# Altium project Kasli-SOC.PrjPcb (part 5 of 11)

## Sheet Kasli-SOC_SFP.SchDoc: SFP
size 420 x 297 mm; EDA_Number: ARTIQ; Projet: ARTIQ/SINARA; CheckedBy: G.Kasprowicz; Author: F.Switakowski; CompanyName: WUT ISE; DrawnBy: F.Switakowski; Organization: WUT ISE; Address1: PW ISE; Address2: Nowowiejska 15/19 00-665 Warsaw; Address3: gkasprow@gmail.com; DocumentNumber: 11; Revision: 1; SheetNumber: 11; SheetTotal: 18; ModifiedBy: -; CheckedDate: -; Title2: cages; DivGrp: WUT ISE; Designer: G.Kasprowicz; ModifiedDate: -; ProjectName: Sensor Box
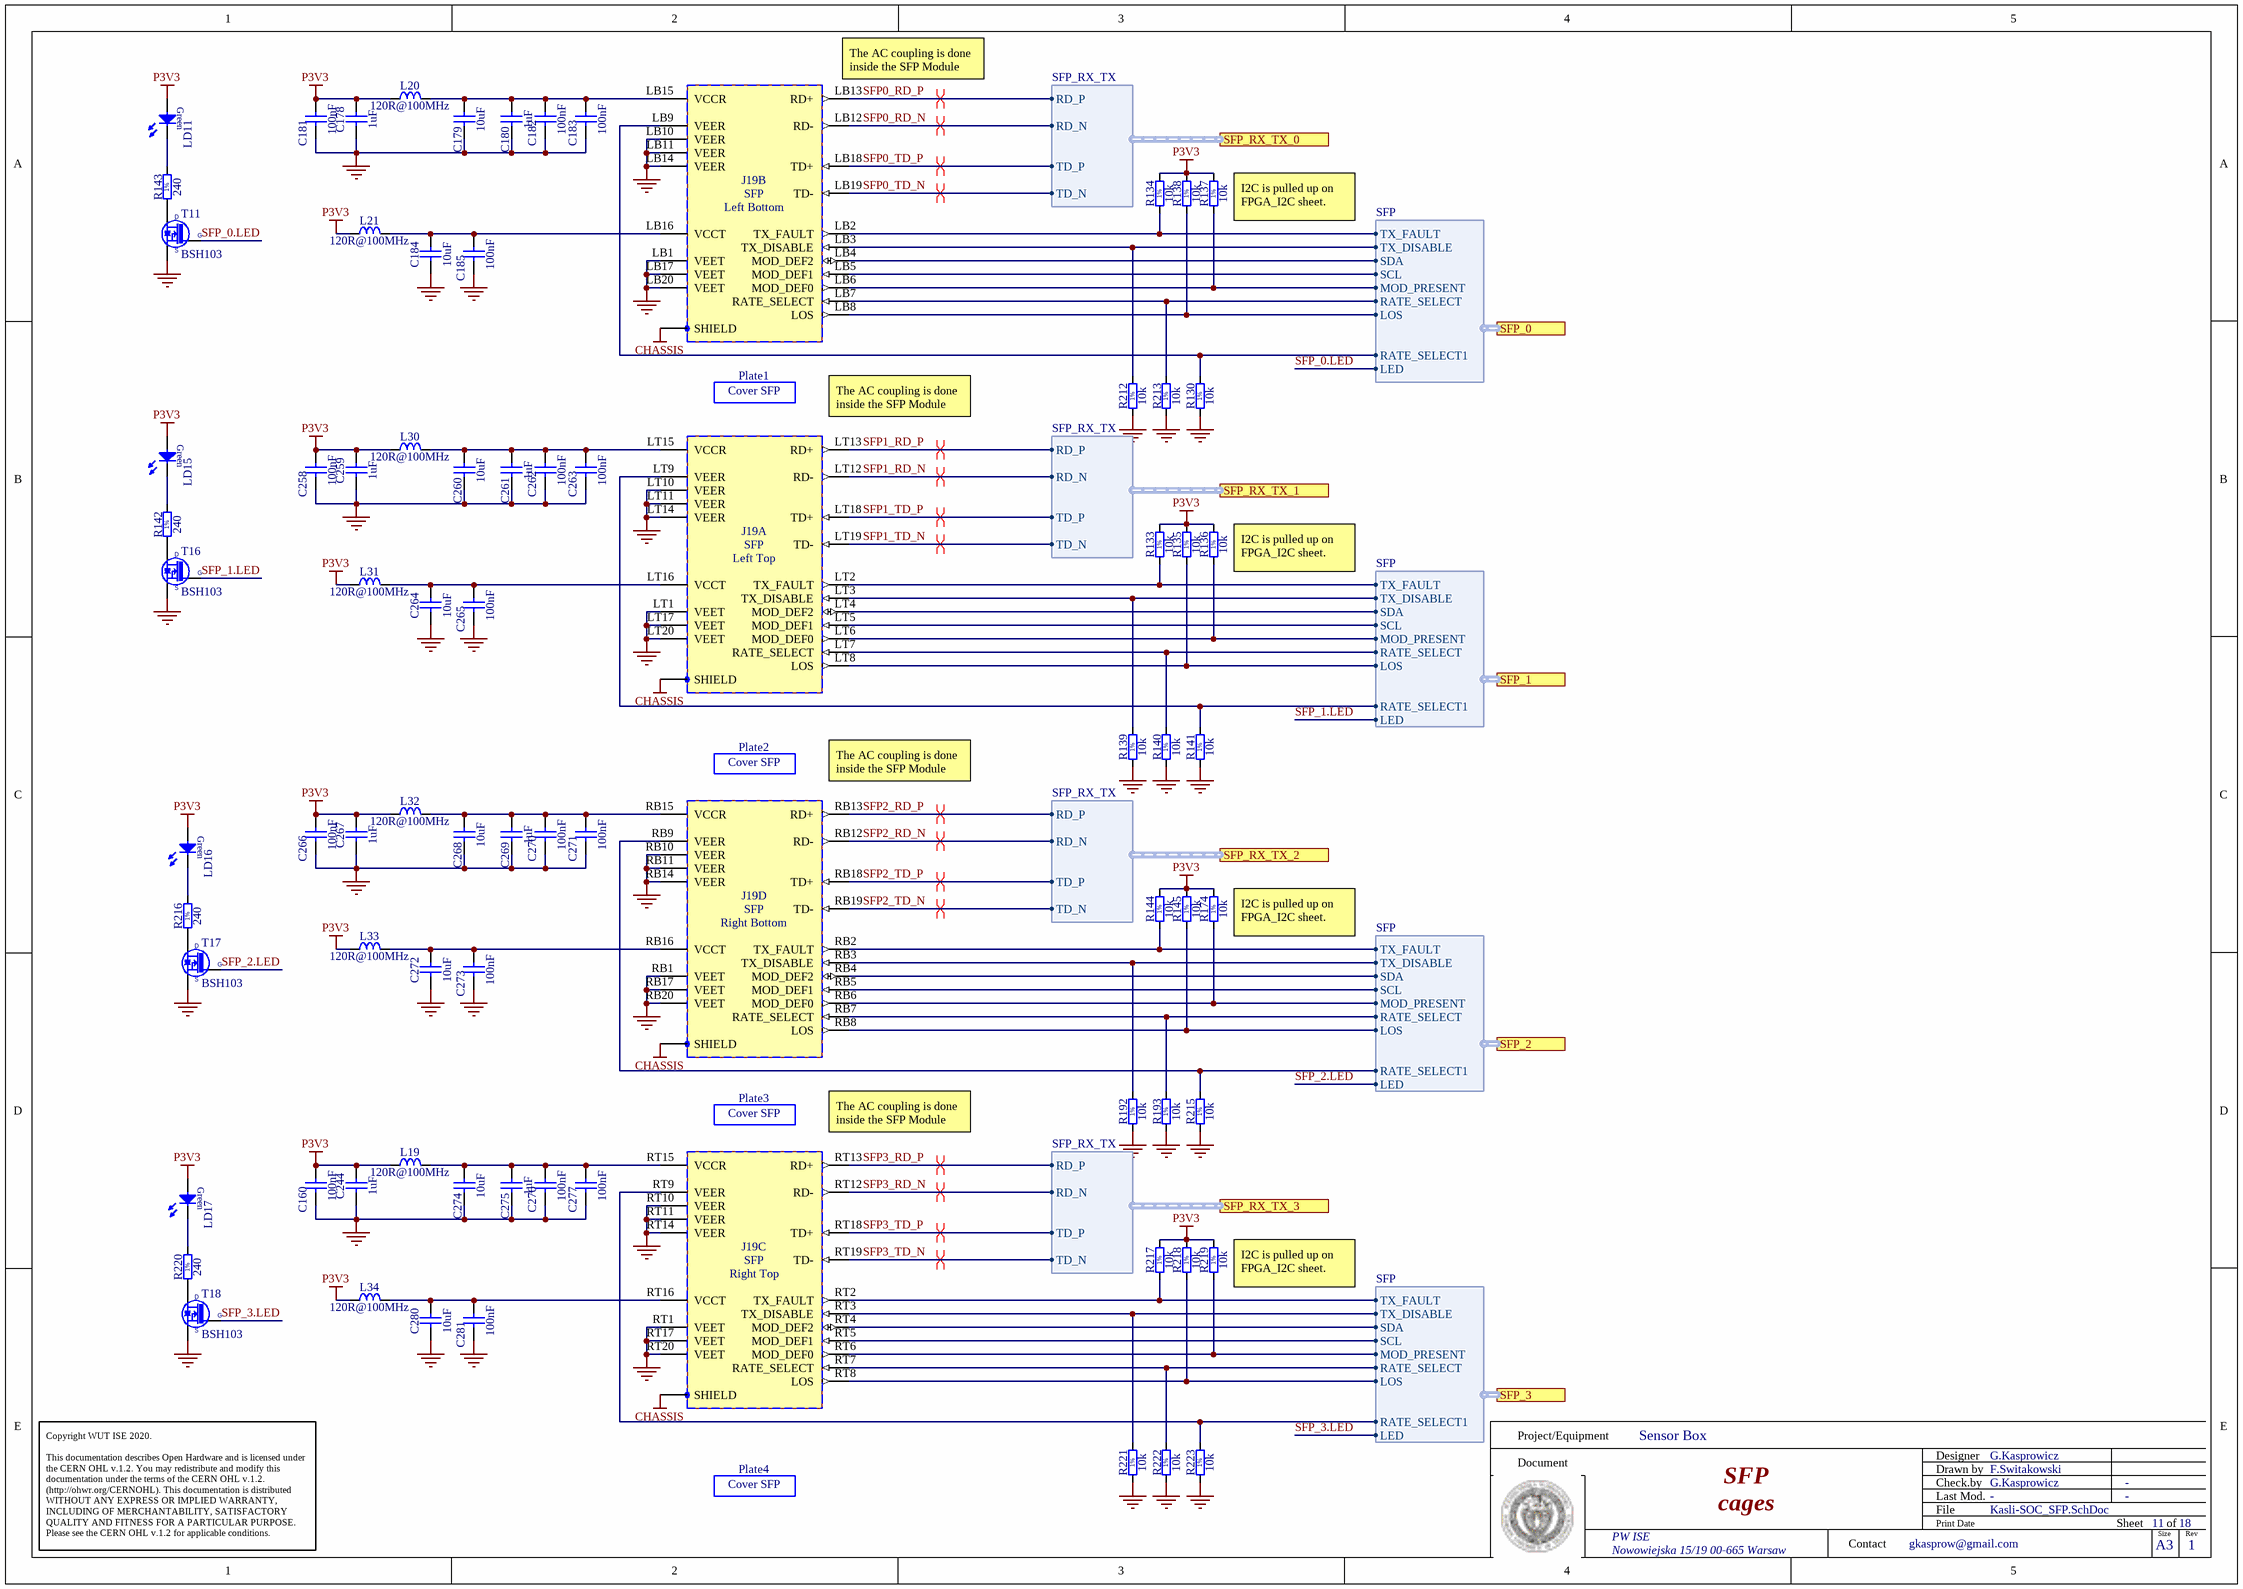
[diagram p9: Kasli-SOC_SFP.SchDoc]

### Parts
C160  100nF  [CAPC1005X55N]
C178  1uF  [CAPC1005X55N]
C179  10uF  [CAPC2012X95N]
C180  1uF  [CAPC1005X55N]
C181  100nF  [CAPC1005X55N]
C182  100nF  [CAPC1005X55N]
C183  100nF  [CAPC1005X55N]
C184  10uF  [CAPC2012X95N]
C185  100nF  [CAPC1005X55N]
C244  1uF  [CAPC1005X55N]
C258  100nF  [CAPC1005X55N]
C259  1uF  [CAPC1005X55N]
C260  10uF  [CAPC2012X95N]
C261  1uF  [CAPC1005X55N]
C262  100nF  [CAPC1005X55N]
C263  100nF  [CAPC1005X55N]
C264  10uF  [CAPC2012X95N]
C265  100nF  [CAPC1005X55N]
C266  100nF  [CAPC1005X55N]
C267  1uF  [CAPC1005X55N]
C268  10uF  [CAPC2012X95N]
C269  1uF  [CAPC1005X55N]
C270  100nF  [CAPC1005X55N]
C271  100nF  [CAPC1005X55N]
C272  10uF  [CAPC2012X95N]
C273  100nF  [CAPC1005X55N]
C274  10uF  [CAPC2012X95N]
C275  1uF  [CAPC1005X55N]
C276  100nF  [CAPC1005X55N]
C277  100nF  [CAPC1005X55N]
C280  10uF  [CAPC2012X95N]
C281  100nF  [CAPC1005X55N]
J19  SFP  [AMPHENOL_UE78B212700321]  (parts A,B,C,D of 4)
L19  120R@100MHz  [INDC1608X65N]
L20  120R@100MHz  [INDC1608X65N]
L21  120R@100MHz  [INDC1608X65N]
L30  120R@100MHz  [INDC1608X65N]
L31  120R@100MHz  [INDC1608X65N]
L32  120R@100MHz  [INDC1608X65N]
L33  120R@100MHz  [INDC1608X65N]
L34  120R@100MHz  [INDC1608X65N]
LD11  Green  [LED_AVAGO_HSME-C120]  (value not drawn)
LD15  Green  [LED_AVAGO_HSME-C120]  (value not drawn)
LD16  Green  [LED_AVAGO_HSME-C120]  (value not drawn)
LD17  Green  [LED_AVAGO_HSME-C120]  (value not drawn)
Plate1  Cover SFP  [AMPHENOL_U77A11108000P]
Plate2  Cover SFP  [AMPHENOL_U77A11108000P]
Plate3  Cover SFP  [AMPHENOL_U77A11108000P]
Plate4  Cover SFP  [AMPHENOL_U77A11108000P]
R130  10k  [RESC1005X40N]
R133  10k  [RESC1005X40N]
R134  10k  [RESC1005X40N]
R135  10k  [RESC1005X40N]
R136  10k  [RESC1005X40N]
R137  10k  [RESC1005X40N]
R138  10k  [RESC1005X40N]
R139  10k  [RESC1005X40N]
R140  10k  [RESC1005X40N]
R141  10k  [RESC1005X40N]
R142  240  [RESC1005X40N]
R143  240  [RESC1005X40N]
R144  10k  [RESC1005X40N]
R145  10k  [RESC1005X40N]
R174  10k  [RESC1005X40N]
R192  10k  [RESC1005X40N]
R193  10k  [RESC1005X40N]
R212  10k  [RESC1005X40N]
R213  10k  [RESC1005X40N]
R215  10k  [RESC1005X40N]
R216  240  [RESC1005X40N]
R217  10k  [RESC1005X40N]
R218  10k  [RESC1005X40N]
R219  10k  [RESC1005X40N]
R220  240  [RESC1005X40N]
R221  10k  [RESC1005X40N]
R222  10k  [RESC1005X40N]
R223  10k  [RESC1005X40N]
T11  BSH103  [SOT95P230X110-3N]
T16  BSH103  [SOT95P230X110-3N]
T17  BSH103  [SOT95P230X110-3N]
T18  BSH103  [SOT95P230X110-3N]

### Ports
SFP_0 (harness SFP), SFP_1 (harness SFP), SFP_2 (harness SFP), SFP_3 (harness SFP), SFP_RX_TX_0 (harness SFP_RX_TX), SFP_RX_TX_1 (harness SFP_RX_TX), SFP_RX_TX_2 (harness SFP_RX_TX), SFP_RX_TX_3 (harness SFP_RX_TX)

### Harnesses
SFP_RX_TX: RD_P, RD_N, TD_P, TD_N
SFP: TX_FAULT, LOS, MOD_PRESENT, TX_DISABLE, RATE_SELECT, LED, RATE_SELECT1, SDA, SCL

### Nets
CHASSIS: J19.SHIELD
GND: C160.1 C178.1 C179.1 C180.1 C181.1 C182.1 C183.1 C184.1 C185.1 C244.1 C258.1 C259.1 C260.1 C261.1 C262.1 C263.1 C264.1 C265.1 C266.1 C267.1 C268.1 C269.1 C270.1 C271.1 C272.1 C273.1 C274.1 C275.1 C276.1 C277.1 C280.1 C281.1 J19.LB1(VEET) J19.LB10(VEER) J19.LB11(VEER) J19.LB14(VEER) J19.LB17(VEET) J19.LB20(VEET) J19.LT1(VEET) J19.LT10(VEER) J19.LT11(VEER) J19.LT14(VEER) J19.LT17(VEET) J19.LT20(VEET) J19.RB1(VEET) J19.RB10(VEER) J19.RB11(VEER) J19.RB14(VEER) J19.RB17(VEET) J19.RB20(VEET) J19.RT1(VEET) J19.RT10(VEER) J19.RT11(VEER) J19.RT14(VEER) J19.RT17(VEET) J19.RT20(VEET) R130.1 R139.1 R140.1 R141.1 R192.1 R193.1 R212.1 R213.1 R215.1 R221.1 R222.1 R223.1 T11.2(S) T16.2(S) T17.2(S) T18.2(S)
P3V3: C160.2 C178.2 C181.2 C244.2 C258.2 C259.2 C266.2 C267.2 L19.1 L20.1 L21.1 L30.1 L31.1 L32.1 L33.1 L34.1 LD11.2(A) LD15.2(A) LD16.2(A) LD17.2(A) R133.2 R134.2 R135.2 R136.2 R137.2 R138.2 R144.2 R145.2 R174.2 R217.2 R218.2 R219.2
SFP0_RD_N: J19.LB12(RD-) ; port SFP_RX_TX_0.RD_N
SFP0_RD_P: J19.LB13(RD+) ; port SFP_RX_TX_0.RD_P
SFP0_TD_N: J19.LB19(TD-) ; port SFP_RX_TX_0.TD_N
SFP0_TD_P: J19.LB18(TD+) ; port SFP_RX_TX_0.TD_P
SFP1_RD_N: J19.LT12(RD-) ; port SFP_RX_TX_1.RD_N
SFP1_RD_P: J19.LT13(RD+) ; port SFP_RX_TX_1.RD_P
SFP1_TD_N: J19.LT19(TD-) ; port SFP_RX_TX_1.TD_N
SFP1_TD_P: J19.LT18(TD+) ; port SFP_RX_TX_1.TD_P
SFP2_RD_N: J19.RB12(RD-) ; port SFP_RX_TX_2.RD_N
SFP2_RD_P: J19.RB13(RD+) ; port SFP_RX_TX_2.RD_P
SFP2_TD_N: J19.RB19(TD-) ; port SFP_RX_TX_2.TD_N
SFP2_TD_P: J19.RB18(TD+) ; port SFP_RX_TX_2.TD_P
SFP3_RD_N: J19.RT12(RD-) ; port SFP_RX_TX_3.RD_N
SFP3_RD_P: J19.RT13(RD+) ; port SFP_RX_TX_3.RD_P
SFP3_TD_N: J19.RT19(TD-) ; port SFP_RX_TX_3.TD_N
SFP3_TD_P: J19.RT18(TD+) ; port SFP_RX_TX_3.TD_P
SFP_0.LED: T11.1(G) ; port SFP_0.LED
SFP_0.LOS: J19.LB8(LOS) R138.1 ; port SFP_0.LOS
SFP_0.MOD_PRESENT: J19.LB6(MOD_DEF0) R137.1 ; port SFP_0.MOD_PRESENT
SFP_0.RATE_SELECT: J19.LB7(RATE_SELECT) R213.2 ; port SFP_0.RATE_SELECT
SFP_0.RATE_SELECT1: J19.LB9(VEER) R130.2 ; port SFP_0.RATE_SELECT1
SFP_0.SCL: J19.LB5(MOD_DEF1) ; port SFP_0.SCL
SFP_0.SDA: J19.LB4(MOD_DEF2) ; port SFP_0.SDA
SFP_0.TX_DISABLE: J19.LB3(TX_DISABLE) R212.2 ; port SFP_0.TX_DISABLE
SFP_0.TX_FAULT: J19.LB2(TX_FAULT) R134.1 ; port SFP_0.TX_FAULT
SFP_1.LED: T16.1(G) ; port SFP_1.LED
SFP_1.LOS: J19.LT8(LOS) R135.1 ; port SFP_1.LOS
SFP_1.MOD_PRESENT: J19.LT6(MOD_DEF0) R136.1 ; port SFP_1.MOD_PRESENT
SFP_1.RATE_SELECT: J19.LT7(RATE_SELECT) R140.2 ; port SFP_1.RATE_SELECT
SFP_1.RATE_SELECT1: J19.LT9(VEER) R141.2 ; port SFP_1.RATE_SELECT1
SFP_1.SCL: J19.LT5(MOD_DEF1) ; port SFP_1.SCL
SFP_1.SDA: J19.LT4(MOD_DEF2) ; port SFP_1.SDA
SFP_1.TX_DISABLE: J19.LT3(TX_DISABLE) R139.2 ; port SFP_1.TX_DISABLE
SFP_1.TX_FAULT: J19.LT2(TX_FAULT) R133.1 ; port SFP_1.TX_FAULT
SFP_2.LED: T17.1(G) ; port SFP_2.LED
SFP_2.LOS: J19.RB8(LOS) R145.1 ; port SFP_2.LOS
SFP_2.MOD_PRESENT: J19.RB6(MOD_DEF0) R174.1 ; port SFP_2.MOD_PRESENT
SFP_2.RATE_SELECT: J19.RB7(RATE_SELECT) R193.2 ; port SFP_2.RATE_SELECT
SFP_2.RATE_SELECT1: J19.RB9(VEER) R215.2 ; port SFP_2.RATE_SELECT1
SFP_2.SCL: J19.RB5(MOD_DEF1) ; port SFP_2.SCL
SFP_2.SDA: J19.RB4(MOD_DEF2) ; port SFP_2.SDA
SFP_2.TX_DISABLE: J19.RB3(TX_DISABLE) R192.2 ; port SFP_2.TX_DISABLE
SFP_2.TX_FAULT: J19.RB2(TX_FAULT) R144.1 ; port SFP_2.TX_FAULT
SFP_3.LED: T18.1(G) ; port SFP_3.LED
SFP_3.LOS: J19.RT8(LOS) R218.1 ; port SFP_3.LOS
SFP_3.MOD_PRESENT: J19.RT6(MOD_DEF0) R219.1 ; port SFP_3.MOD_PRESENT
SFP_3.RATE_SELECT: J19.RT7(RATE_SELECT) R222.2 ; port SFP_3.RATE_SELECT
SFP_3.RATE_SELECT1: J19.RT9(VEER) R223.2 ; port SFP_3.RATE_SELECT1
SFP_3.SCL: J19.RT5(MOD_DEF1) ; port SFP_3.SCL
SFP_3.SDA: J19.RT4(MOD_DEF2) ; port SFP_3.SDA
SFP_3.TX_DISABLE: J19.RT3(TX_DISABLE) R221.2 ; port SFP_3.TX_DISABLE
SFP_3.TX_FAULT: J19.RT2(TX_FAULT) R217.1 ; port SFP_3.TX_FAULT
NetC179_2: C179.2 C180.2 C182.2 C183.2 J19.LB15(VCCR) L20.2
NetC184_2: C184.2 C185.2 J19.LB16(VCCT) L21.2
NetC260_2: C260.2 C261.2 C262.2 C263.2 J19.LT15(VCCR) L30.2
NetC264_2: C264.2 C265.2 J19.LT16(VCCT) L31.2
NetC268_2: C268.2 C269.2 C270.2 C271.2 J19.RB15(VCCR) L32.2
NetC272_2: C272.2 C273.2 J19.RB16(VCCT) L33.2
NetC274_2: C274.2 C275.2 C276.2 C277.2 J19.RT15(VCCR) L19.2
NetC280_2: C280.2 C281.2 J19.RT16(VCCT) L34.2
NetLD11_1: LD11.1(C) R143.2
NetLD15_1: LD15.1(C) R142.2
NetLD16_1: LD16.1(C) R216.2
NetLD17_1: LD17.1(C) R220.2
NetR142_1: R142.1 T16.3(D)
NetR143_1: R143.1 T11.3(D)
NetR216_1: R216.1 T17.3(D)
NetR220_1: R220.1 T18.3(D)

### Layout directives
differential pair; differential pair class Diff_100Ohm: SFP0_RD_N, SFP0_RD_P, SFP0_TD_N, SFP0_TD_P, SFP1_RD_N, SFP1_RD_P, SFP1_TD_N, SFP1_TD_P, SFP2_RD_N, SFP2_RD_P, SFP2_TD_N, SFP2_TD_P, SFP3_RD_N, SFP3_RD_P, SFP3_TD_N, SFP3_TD_P

### Notes on the sheet
- (near J19) The AC coupling is done inside the SFP Module
- (near R137) I2C is pulled up on FPGA_I2C sheet.
- (near R136) I2C is pulled up on FPGA_I2C sheet.
- (near R174) I2C is pulled up on FPGA_I2C sheet.
- (near R219) I2C is pulled up on FPGA_I2C sheet.
- Project/Equipment
- Document
- Designer
- Drawn by
- Check.by
- Copyright WUT ISE 2020.
  This documentation describes Open Hardware and is licensed under the CERN OHL v.1.2. You may redistribute and modify this documentation under the terms of the CERN OHL v.1.2. (http://ohwr.org/CERNOHL). This documentation is distributed WITHOUT ANY EXPRESS OR IMPLIED WARRANTY, INCLUDING OF MERCHANTABILITY, SATISFACTORY QUALITY AND FITNESS FOR A PARTICULAR PURPOSE. Please see the CERN OHL v.1.2 for applicable conditions.
- Contact
- File
- Last Mod.
- Print Date
- Sheet
- Size
- A3
- of
- Rev
- (in symbol AMPHENOL_UE78B212700321, part A) Left Top
- (in symbol AMPHENOL_UE78B212700321, part B) Left Bottom
- (in symbol AMPHENOL_UE78B212700321, part C) Right Top
- (in symbol AMPHENOL_UE78B212700321, part D) Right Bottom
- (in symbol R0402_10K_1%_0.0625W_100PPM) 1%
- (in symbol R0402_240R_1%_0.0625W_100PPM) 1%

### Library data of the parts
C160 C181-C183 C185 C258 C262 C263 C265 C266 C270 C271 C273 C276 C277 C281 = CC0402_100NF_16V_10%_X7R: Non-polarised capacitor; Part Description: SMD Multilayer Chip Ceramic Capacitor; Manufacturer: GENERIC; Manufacturer1 Part Number: GRM155R71C104KA88D; Voltage: 16V; TC: X7R; Tolerance: ±10%; Part Number: CC0402_100NF_16V_10%_X7R; Component Kind: Standard; Component Type: Standard; Pin Count: 2; Value: 100nF; Status: Not Recommended; Manufacturer Part Number: CC0402_100NF_16V_10%_X7R; Case: 0402; Mounted: Yes; Socket: No; SMD: Yes; Sense: No; Manufacturer1 Example: MURATA; Manufacturer1 ComponentHeight: 0.55mm; HelpURL: \\cern.ch\dfs\Applications\Altium\Datasheets\CC0402_X7R_MURATA_GRM.pdf; Author: CERN DEM JLC; CreateDate: 05.12.2013; LatestRevisionDate: 03.12.2007
C178 C180 C244 C259 C261 C267 C269 C275 = CC0402_1UF_16V_10%_X5R: Non-polarised capacitor; Part Description: SMD Multilayer Chip Ceramic Capacitor; Manufacturer: GENERIC; Manufacturer1 Part Number: C1005X5R1C105KT; Voltage: 16V; TC: X5R; Tolerance: ±10%; Part Number: CC0402_1UF_16V_10%_X5R; Component Kind: Standard; Component Type: Standard; Pin Count: 2; Value: 1uF; Status: Preferred; Manufacturer Part Number: CC0402_1UF_16V_10%_X5R; Case: 0402; Mounted: Yes; Socket: No; SMD: Yes; Sense: No; Manufacturer1 Example: TDK; Manufacturer1 ComponentHeight: 0.55mm; HelpURL: \\cern.ch\dfs\Applications\Altium\Datasheets\CC0402_X5R_TDK_C.pdf; Author: CERN DEM JLC; CreateDate: 2012-10-25; LatestRevisionDate: 2012-10-25
C179 C184 C260 C264 C268 C272 C274 C280 = CC0805_10UF_25V_10%_X5R: Non-polarised capacitor; Part Description: SMD Multilayer Chip Ceramic Capacitor; Manufacturer: GENERIC; Manufacturer1 Part Number: GRM219R61E106KA12D; Voltage: 25V; TC: X5R; Tolerance: ±10%; Part Number: CC0805_10UF_25V_10%_X5R; Component Kind: Standard; Component Type: Standard; Pin Count: 2; Value: 10uF; Status: Preferred; Manufacturer Part Number: CC0805_10UF_25V_10%_X5R; Case: 0805; Mounted: Yes; Socket: No; SMD: Yes; Sense: No; Manufacturer1 Example: MURATA; Manufacturer1 ComponentHeight: 0.95mm; HelpURL: \\cern.ch\dfs\Applications\Altium\Datasheets\CC0805_X5R_MURATA_GRM.pdf; Author: CERN DEM JLC; CreateDate: 25.10.2012; LatestRevisionDate: 06.09.2016
J19 = AMPHENOL_UE78B212700321: 20 Position SFP  Connector (Small Form-factor Pluggable); Part Description: 2x2 SFP Cage (Small Form-factor Pluggable) with 4x20 Positions Integrated Receptacles (Press Fit Tails); Part Number: AMPHENOL_UE78B212700321; Component Kind: Standard; Component Type: Standard; Pin Count: 110; Family: SFP; Mounted: Yes; Socket: No; SMD: No; PressFit: Yes; Sense: No; Status: None; Manufacturer: AMPHENOL; Manufacturer Part Number: UE78B212700321; ComponentHeight: 25.45mm; HelpURL: \\cern.ch\dfs\Applications\Altium\Datasheets\AMPHENOL_UE78B212700321.pdf; Author: CERN DEM BC; CreateDate: 25.10.2019; LatestRevisionDate: 25.10.2019
L19-L21 L30-L34 = IND0603_MURATA_BLM18SG121TN1D: Inductor; Part Description: SMD EMIFIL Suppression Chip Ferrite Bead; Manufacturer: MURATA; Power: 3A; Resistance: 0.025R; Tolerance: ±25%; Part Number: IND0603_MURATA_BLM18SG121TN1D; Component Kind: Standard; Component Type: Standard; Pin Count: 2; Value: 120R@100MHz; Status: None; Manufacturer Part Number: BLM18SG121TN1D; Case: 0603; Mounted: Yes; Socket: No; SMD: Yes; Sense: No; ComponentHeight: 0.65mm; HelpURL: \\cern.ch\dfs\Applications\Altium\Datasheets\IND0603_MURATA_BLM18S.pdf; Author: CERN DEM JLC; CreateDate: 23.07.2014; LatestRevisionDate: 23.07.2014
LD11 LD15-LD17 = LED_AVAGO_HSME-C120: LED Green 1C 2A; Part Description: High Performance Right Angle Chip Green LED; Manufacturer: AVAGO TECHNOLOGIES; PressFit: No; Bonding: No; Part Number: LED_AVAGO_HSME-C120; Component Kind: Standard; Component Type: Standard; Color: Green; PackageDescription: Green Chip LED, 2-Leads, Body 1.7x1.1mm, Side Emitting Package; Manufacturer Part Number: HSME-C120; Pin Count: 2; Mounted: Yes; Socket: No; SMD: Yes; Sense: No; ComponentHeight: 0.7mm; HelpURL: \\cern.ch\dfs\Applications\Altium\Datasheets\LED_AVAGO_HSME-C120.pdf; ComponentLink1URL: \\cern.ch\dfs\Applications\Altium\Datasheets\LED_AVAGO_HSME-C110_DESIGN-GUIDE.pdf; ComponentLink1Description: Design Guide; Author: CERN DEM JMW; CreateDate: 22.07.2009; LatestRevisionDate: 20.06.2012
Plate1-Plate4 = AMPHENOL_U77A11108000P: Plastic Dust Cover SFP Cage; PressFit: No; Part Number: AMPHENOL_U77A11108000P; Component Kind: Accessories; Component Type: Standard; Pin Count: 0; PackageDescription: Plastic Dust Cover SFP Cage; Mounted: Yes; Socket: No; SMD: No; Sense: No; Status: None; Value: Cover SFP; Part Description: Plastic Dust Cover SFP Cage; Manufacturer: AMPHENOL; Manufacturer Part Number: U77A11108000P; ComponentHeight: 10.2mm; HelpURL: \\cern.ch\dfs\Applications\Altium\Datasheets\AMPHENOL_U77A11108000P.pdf; Author: CERN DEM BC; CreateDate: 28.10.2019; LatestRevisionDate: 28.10.2019
R130 R133-R141 R144 R145 R174 R192 R193 R212 R213 R215 R217-R219 R221-R223 = R0402_10K_1%_0.0625W_100PPM: Resistor - 1%; Part Description: General Purpose Thick Film Chip Resistor; Manufacturer: GENERIC; Manufacturer1 Part Number: 232270671003L; TC: ±100ppm/°C; PressFit: No; Part Number: R0402_10K_1%_0.0625W_100PPM; Component Kind: Standard; Component Type: Standard; Pin Count: 2; Value: 10k; Status: Not Recommended; Power: 0.0625W; Tolerance: ±1%; Manufacturer Part Number: R0402_10K_1%_0.0625W_100PPM; Case: 0402; Mounted: Yes; Sense: No; Socket: No; SMD: Yes; Manufacturer1 Example: YAGEO PHYCOMP; Manufacturer1 ComponentHeight: 0.4mm; HelpURL: \\cern.ch\dfs\Applications\Altium\Datasheets\R0402_Phycomp_RC0402.pdf; Author: CERN DEM JLC; CreateDate: 03.12.2007; LatestRevisionDate: 17.10.2012
R142 R143 R216 R220 = R0402_240R_1%_0.0625W_100PPM: Resistor - 1%; Part Description: General Purpose Thick Film Chip Resistor; Manufacturer: GENERIC; Manufacturer1 Part Number: 232270672401L; TC: ±100ppm/°C; PressFit: No; Part Number: R0402_240R_1%_0.0625W_100PPM; Component Kind: Standard; Component Type: Standard; Pin Count: 2; Value: 240; Status: Not Recommended; Power: 0.0625W; Tolerance: ±1%; Manufacturer Part Number: R0402_240R_1%_0.0625W_100PPM; Case: 0402; Mounted: Yes; Sense: No; Socket: No; SMD: Yes; Manufacturer1 Example: YAGEO PHYCOMP; Manufacturer1 ComponentHeight: 0.4mm; HelpURL: \\cern.ch\dfs\Applications\Altium\Datasheets\R0402_Phycomp_RC0402.pdf; Author: CERN DEM JLC; CreateDate: 03.12.2007; LatestRevisionDate: 17.10.2012
T11 T16-T18 = BSH103: N-CHANNEL MOSFET WITH DIODE; Part Description: 30V 850mA N-Channel Enhancement Mode Field-Effect Transistor; Manufacturer: NEXPERIA; PressFit: No; Bonding: No; Part Number: BSH103; Component Kind: Standard; Component Type: Standard; Device: BSH103; PackageDescription: SOT23, 3 pin, Pitch 0.95mm - 1.3mm W X 2.9mm L X 1.1mm H, IPC Medium Density; Manufacturer Part Number: BSH103; Pin Count: 3; Case: SOT23-3; Mounted: Yes; Socket: No; SMD: Yes; Sense: No; ComponentHeight: 1.1mm; HelpURL: \\cern.ch\dfs\Applications\Altium\Datasheets\BSH103.pdf; Author: CERN DEM JLC; CreateDate: 16.03.2010; LatestRevisionDate: 20.06.2017

## Sheet Kasli-SOC_MUX_I2C.SchDoc: I2C
size 420 x 297 mm; EDA_Number: ARTIQ; Projet: ARTIQ/SINARA; CheckedBy: G.Kasprowicz; Author: F.Switakowski; CompanyName: WUT ISE; DrawnBy: F.Switakowski; Organization: WUT ISE; Address1: PW ISE; Address2: Nowowiejska 15/19 00-665 Warsaw; Address3: gkasprow@gmail.com; DocumentNumber: 10; Revision: 1; SheetNumber: 10; SheetTotal: 18; ModifiedBy: -; CheckedDate: -; Title2: Subsystem; DivGrp: WUT ISE; Designer: G.Kasprowicz; ModifiedDate: -; ProjectName: Sensor Box
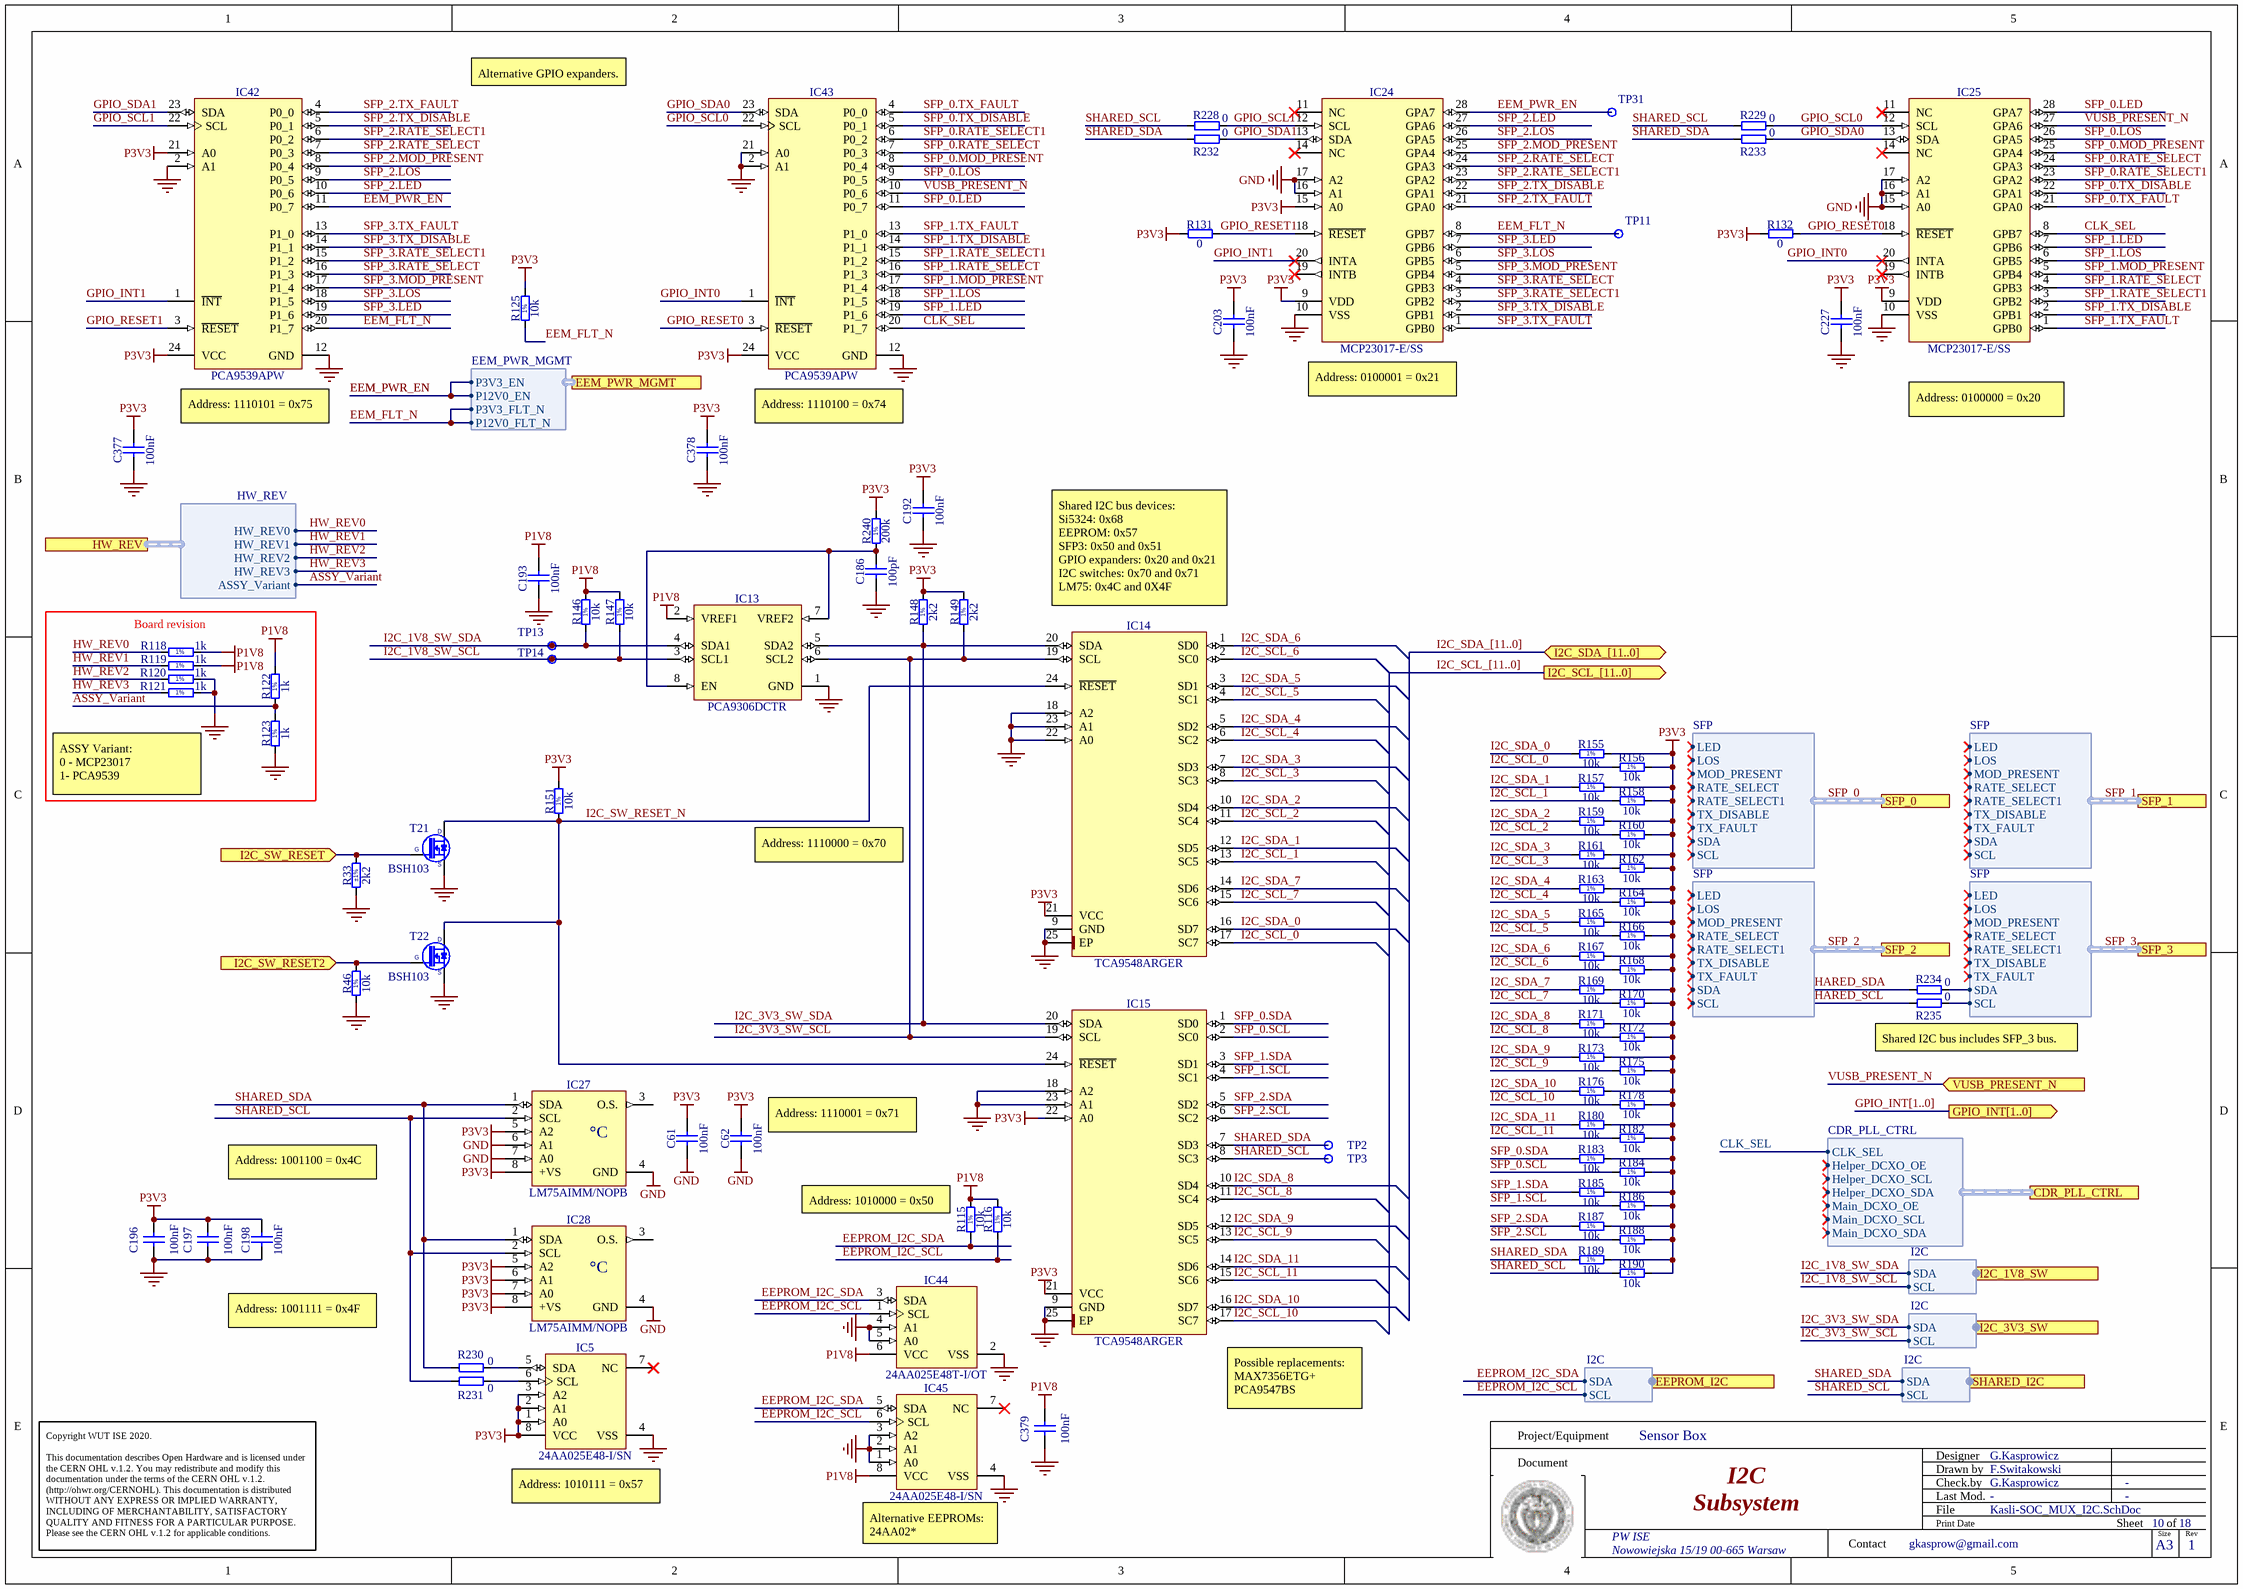
[diagram p10: Kasli-SOC_MUX_I2C.SchDoc]

### Parts
C61  100nF  [CAPC1005X55N]
C62  100nF  [CAPC1005X55N]
C186  100pF  [CAPC1005X55N]
C192  100nF  [CAPC1005X55N]
C193  100nF  [CAPC1005X55N]
C196  100nF  [CAPC0603X33N]
C197  100nF  [CAPC0603X33N]
C198  100nF  [CAPC1005X55N]
C203  100nF  [CAPC1005X55N]
C227  100nF  [CAPC1005X55N]
C377  100nF  [CAPC1005X55N]
C378  100nF  [CAPC1005X55N]
C379  100nF  [CAPC1005X55N]
IC5  24AA025E48-I/SN  [SOIC127P600X175-8N]
IC13  PCA9306DCTR  [SOP65P400X130-8N]
IC14  TCA9548ARGER  [QFN50P400X400X100-25N-S220]
IC15  TCA9548ARGER  [QFN50P400X400X100-25N-S220]
IC24  MCP23017-E/SS  [SOP65P780X200-28N]
IC25  MCP23017-E/SS  [SOP65P780X200-28N]
IC27  LM75AIMM/NOPB  [SOP65P490X109-8N]
IC28  LM75AIMM/NOPB  [SOP65P490X109-8N]
IC42  PCA9539APW  [SOP65P640X110-24N]
IC43  PCA9539APW  [SOP65P640X110-24N]
IC44  24AA025E48T-I/OT  [SOT95P280X145-6N]
IC45  24AA025E48-I/SN  [SOIC127P600X175-8N]
R33  2k2  Tolerance: ±1%  [RESC1005X40N]
R46  10k  [RESC1005X40N]
R115  10k  [RESC1005X40N]
R116  10k  [RESC1005X40N]
R118  1k  [RESC1005X40N]
R119  1k  [RESC1005X40N]
R120  1k  [RESC1005X40N]
R121  1k  [RESC1005X40N]
R122  1k  [RESC1005X40N]
R123  1k  [RESC1005X40N]
R125  10k  [RESC1005X40N]
R131  0  [RESC1005X40N]
R132  0  [RESC1005X40N]
R146  10k  [RESC1005X40N]
R147  10k  [RESC1005X40N]
R148  2k2  [RESC1005X40N]
R149  2k2  [RESC1005X40N]
R151  10k  [RESC1005X40N]
R155  10k  [RESC1005X40N]
R156  10k  [RESC1005X40N]
R157  10k  [RESC1005X40N]
R158  10k  [RESC1005X40N]
R159  10k  [RESC1005X40N]
R160  10k  [RESC1005X40N]
R161  10k  [RESC1005X40N]
R162  10k  [RESC1005X40N]
R163  10k  [RESC1005X40N]
R164  10k  [RESC1005X40N]
R165  10k  [RESC1005X40N]
R166  10k  [RESC1005X40N]
R167  10k  [RESC1005X40N]
R168  10k  [RESC1005X40N]
R169  10k  [RESC1005X40N]
R170  10k  [RESC1005X40N]
R171  10k  [RESC1005X40N]
R172  10k  [RESC1005X40N]
R173  10k  [RESC1005X40N]
R175  10k  [RESC1005X40N]
R176  10k  [RESC1005X40N]
R178  10k  [RESC1005X40N]
R180  10k  [RESC1005X40N]
R182  10k  [RESC1005X40N]
R183  10k  [RESC1005X40N]
R184  10k  [RESC1005X40N]
R185  10k  [RESC1005X40N]
R186  10k  [RESC1005X40N]
R187  10k  [RESC1005X40N]
R188  10k  [RESC1005X40N]
R189  10k  [RESC1005X40N]
R190  10k  [RESC1005X40N]
R228  0  [RESC1005X40N]
R229  0  [RESC1005X40N]
R230  0  [RESC1005X40N]
R231  0  [RESC1005X40N]
R232  0  [RESC1005X40N]
R233  0  [RESC1005X40N]
R234  0  [RESC1005X40N]
R235  0  [RESC1005X40N]
R240  200k  [RESC1005X40N]
T21  BSH103  [SOT95P230X110-3N]
T22  BSH103  [SOT95P230X110-3N]
TP2  Si5324 I2C SDA  [TPS127]  (value not drawn)  (no BOM)
TP3  Si5324 I2C SCL  [TPS127]  (value not drawn)  (no BOM)
TP11  I2C SW SCL  [TPS127]  (value not drawn)  (no BOM)
TP13  I2C SW SDA  [TPS127]  (value not drawn)  (no BOM)
TP14  I2C SW SCL  [TPS127]  (value not drawn)  (no BOM)
TP31  I2C SW SCL  [TPS127]  (value not drawn)  (no BOM)

### Blocks framed on the sheet
Board revision: R118-R123

### Ports
CDR_PLL_CTRL (harness CDR_PLL_CTRL), EEM_PWR_MGMT (harness EEM_PWR_MGMT), EEPROM_I2C (harness I2C), GPIO_INT[1..0] (out), HW_REV (harness HW_REV), I2C_1V8_SW (harness I2C), I2C_3V3_SW (harness I2C), I2C_SCL_[11..0] (out), I2C_SDA_[11..0] (bidir), I2C_SW_RESET2 (in), I2C_SW_RESET (in), SFP_0 (harness SFP), SFP_1 (harness SFP), SFP_2 (harness SFP), SFP_3 (harness SFP), SHARED_I2C (harness I2C), VUSB_PRESENT_N (in)

### Harnesses
SFP: LED, LOS, MOD_PRESENT, RATE_SELECT, RATE_SELECT1, TX_DISABLE, TX_FAULT, SDA, SCL
CDR_PLL_CTRL: CLK_SEL, Helper_DCXO_OE, Helper_DCXO_SCL, Helper_DCXO_SDA, Main_DCXO_OE, Main_DCXO_SCL, Main_DCXO_SDA
I2C: SDA, SCL
HW_REV: ASSY_Variant, HW_REV3, HW_REV2, HW_REV1, HW_REV0
EEM_PWR_MGMT: P3V3_EN, P12V0_EN, P3V3_FLT_N, P12V0_FLT_N

### Nets
GND: C61.1 C62.1 C186.1 C192.1 C193.1 C196.1 C197.1 C198.1 C203.1 C227.1 C377.1 C378.1 C379.1 IC5.4(VSS) IC13.1(GND) IC14.9(GND) IC14.18(A2) IC14.22(A0) IC14.23(A1) IC14.25(EP) IC15.9(GND) IC15.18(A2) IC15.23(A1) IC15.25(EP) IC24.10(VSS) IC24.16(A1) IC24.17(A2) IC25.10(VSS) IC25.15(A0) IC25.16(A1) IC25.17(A2) IC27.4(GND) IC27.6(A1) IC27.7(A0) IC28.4(GND) IC42.2(A1) IC42.12(GND) IC43.2(A1) IC43.12(GND) IC43.21(A0) IC44.2(VSS) IC44.4(A1) IC44.5(A0) IC45.1(A0) IC45.2(A1) IC45.3(A2) IC45.4(VSS) R33.1 R46.1 R120.2 R121.2 R123.1 T21.2(S) T22.2(S)
P1V8: C193.2 C379.2 IC13.2(VREF1) IC44.6(VCC) IC45.8(VCC) R115.2 R116.2 R118.2 R119.2 R122.2 R146.2 R147.2
P3V3: C61.2 C62.2 C192.2 C196.2 C197.2 C198.2 C203.2 C227.2 C377.2 C378.2 IC5.1(A0) IC5.2(A1) IC5.3(A2) IC5.8(VCC) IC14.21(VCC) IC15.21(VCC) IC15.22(A0) IC24.9(VDD) IC24.15(A0) IC25.9(VDD) IC27.5(A2) IC27.8(+VS) IC28.5(A2) IC28.6(A1) IC28.7(A0) IC28.8(+VS) IC42.21(A0) IC42.24(VCC) IC43.24(VCC) R125.2 R131.1 R132.1 R148.2 R149.2 R151.2 R155.2 R156.2 R157.2 R158.2 R159.2 R160.2 R161.2 R162.2 R163.2 R164.2 R165.2 R166.2 R167.2 R168.2 R169.2 R170.2 R171.2 R172.2 R173.2 R175.2 R176.2 R178.2 R180.2 R182.2 R183.2 R184.2 R185.2 R186.2 R187.2 R188.2 R189.2 R190.2 R240.2
ASSY_Variant: R122.1 R123.2 ; port HW_REV.ASSY_Variant
CLK_SEL: IC25.8(GPB7) IC43.20(P1_7) ; port CDR_PLL_CTRL.CLK_SEL
EEM_FLT_N: IC24.8(GPB7) IC42.20(P1_7) R125.1 TP11.1 ; port EEM_PWR_MGMT.P3V3_FLT_N, port EEM_PWR_MGMT.P12V0_FLT_N
EEM_PWR_EN: IC24.28(GPA7) IC42.11(P0_7) TP31.1 ; port EEM_PWR_MGMT.P3V3_EN, port EEM_PWR_MGMT.P12V0_EN
EEPROM_I2C_SCL: IC44.1(SCL) IC45.6(SCL) R116.1 ; port EEPROM_I2C.SCL
EEPROM_I2C_SDA: IC44.3(SDA) IC45.5(SDA) R115.1 ; port EEPROM_I2C.SDA
GPIO_INT0: IC25.20(INTA) IC43.1(~{INT})
GPIO_INT1: IC24.20(INTA) IC42.1(~{INT})
GPIO_RESET0: IC25.18(~{RESET}) IC43.3(~{RESET}) R132.2
GPIO_RESET1: IC24.18(~{RESET}) IC42.3(~{RESET}) R131.2
GPIO_SCL0: IC25.12(SCL) IC43.22(SCL) R229.2
GPIO_SCL1: IC24.12(SCL) IC42.22(SCL) R228.2
GPIO_SDA0: IC25.13(SDA) IC43.23(SDA) R233.2
GPIO_SDA1: IC24.13(SDA) IC42.23(SDA) R232.2
HW_REV0: R118.1 ; port HW_REV.HW_REV0
HW_REV1: R119.1 ; port HW_REV.HW_REV1
HW_REV2: R120.1 ; port HW_REV.HW_REV2
HW_REV3: R121.1 ; port HW_REV.HW_REV3
I2C_1V8_SW_SCL: IC13.3(SCL1) R147.1 TP14.1 ; port I2C_1V8_SW.SCL
I2C_1V8_SW_SDA: IC13.4(SDA1) R146.1 TP13.1 ; port I2C_1V8_SW.SDA
I2C_3V3_SW_SCL: IC13.6(SCL2) IC14.19(SCL) IC15.19(SCL) R149.1 ; port I2C_3V3_SW.SCL
I2C_3V3_SW_SDA: IC13.5(SDA2) IC14.20(SDA) IC15.20(SDA) R148.1 ; port I2C_3V3_SW.SDA
I2C_SCL_0: IC14.17(SC7) R156.1
I2C_SCL_1: IC14.13(SC5) R158.1
I2C_SCL_2: IC14.11(SC4) R160.1
I2C_SCL_3: IC14.8(SC3) R162.1
I2C_SCL_4: IC14.6(SC2) R164.1
I2C_SCL_5: IC14.4(SC1) R166.1
I2C_SCL_6: IC14.2(SC0) R168.1
I2C_SCL_7: IC14.15(SC6) R170.1
I2C_SCL_8: IC15.11(SC4) R172.1
I2C_SCL_9: IC15.13(SC5) R175.1
I2C_SCL_10: IC15.17(SC7) R178.1
I2C_SCL_11: IC15.15(SC6) R182.1
I2C_SDA_0: IC14.16(SD7) R155.1
I2C_SDA_1: IC14.12(SD5) R157.1
I2C_SDA_2: IC14.10(SD4) R159.1
I2C_SDA_3: IC14.7(SD3) R161.1
I2C_SDA_4: IC14.5(SD2) R163.1
I2C_SDA_5: IC14.3(SD1) R165.1
I2C_SDA_6: IC14.1(SD0) R167.1
I2C_SDA_7: IC14.14(SD6) R169.1
I2C_SDA_8: IC15.10(SD4) R171.1
I2C_SDA_9: IC15.12(SD5) R173.1
I2C_SDA_10: IC15.16(SD7) R176.1
I2C_SDA_11: IC15.14(SD6) R180.1
I2C_SW_RESET: R33.2 T21.1(G) ; port I2C_SW_RESET
I2C_SW_RESET2: R46.2 T22.1(G) ; port I2C_SW_RESET2
I2C_SW_RESET_N: IC14.24(~{RESET}) IC15.24(~{RESET}) R151.1 T21.3(D) T22.3(D)
SFP_0.LED: IC25.28(GPA7) IC43.11(P0_7)
SFP_0.LOS: IC25.26(GPA5) IC43.9(P0_5)
SFP_0.MOD_PRESENT: IC25.25(GPA4) IC43.8(P0_4)
SFP_0.RATE_SELECT: IC25.24(GPA3) IC43.7(P0_3)
SFP_0.RATE_SELECT1: IC25.23(GPA2) IC43.6(P0_2)
SFP_0.SCL: IC15.2(SC0) R184.1
SFP_0.SDA: IC15.1(SD0) R183.1
SFP_0.TX_DISABLE: IC25.22(GPA1) IC43.5(P0_1)
SFP_0.TX_FAULT: IC25.21(GPA0) IC43.4(P0_0)
SFP_1.LED: IC25.7(GPB6) IC43.19(P1_6)
SFP_1.LOS: IC25.6(GPB5) IC43.18(P1_5)
SFP_1.MOD_PRESENT: IC25.5(GPB4) IC43.17(P1_4)
SFP_1.RATE_SELECT: IC25.4(GPB3) IC43.16(P1_3)
SFP_1.RATE_SELECT1: IC25.3(GPB2) IC43.15(P1_2)
SFP_1.SCL: IC15.4(SC1) R186.1
SFP_1.SDA: IC15.3(SD1) R185.1
SFP_1.TX_DISABLE: IC25.2(GPB1) IC43.14(P1_1)
SFP_1.TX_FAULT: IC25.1(GPB0) IC43.13(P1_0)
SFP_2.LED: IC24.27(GPA6) IC42.10(P0_6)
SFP_2.LOS: IC24.26(GPA5) IC42.9(P0_5)
SFP_2.MOD_PRESENT: IC24.25(GPA4) IC42.8(P0_4)
SFP_2.RATE_SELECT: IC24.24(GPA3) IC42.7(P0_3)
SFP_2.RATE_SELECT1: IC24.23(GPA2) IC42.6(P0_2)
SFP_2.SCL: IC15.6(SC2) R188.1
SFP_2.SDA: IC15.5(SD2) R187.1
SFP_2.TX_DISABLE: IC24.22(GPA1) IC42.5(P0_1)
SFP_2.TX_FAULT: IC24.21(GPA0) IC42.4(P0_0)
SFP_3.LED: IC24.7(GPB6) IC42.19(P1_6)
SFP_3.LOS: IC24.6(GPB5) IC42.18(P1_5)
SFP_3.MOD_PRESENT: IC24.5(GPB4) IC42.17(P1_4)
SFP_3.RATE_SELECT: IC24.4(GPB3) IC42.16(P1_3)
SFP_3.RATE_SELECT1: IC24.3(GPB2) IC42.15(P1_2)
SFP_3.SCL: R235.2 ; port SFP_3.SCL
SFP_3.SDA: R234.2 ; port SFP_3.SDA
SFP_3.TX_DISABLE: IC24.2(GPB1) IC42.14(P1_1)
SFP_3.TX_FAULT: IC24.1(GPB0) IC42.13(P1_0)
SHARED_SCL: IC15.8(SC3) IC27.2(SCL) IC28.2(SCL) R190.1 R228.1 R229.1 R231.1 R235.1 TP3.1 ; port SHARED_I2C.SCL
SHARED_SDA: IC15.7(SD3) IC27.1(SDA) IC28.1(SDA) R189.1 R230.1 R232.1 R233.1 R234.1 TP2.1 ; port SHARED_I2C.SDA
VUSB_PRESENT_N: IC25.27(GPA6) IC43.10(P0_6) ; port VUSB_PRESENT_N
NetC186_2: C186.2 IC13.7(VREF2) IC13.8(EN) R240.1
NetIC5_5: IC5.5(SDA) R230.2
NetIC5_6: IC5.6(SCL) R231.2

Not connected (* = marked no-connect by the designer): IC5 7(NC)*; IC24 11(NC)* 14(NC)* 19(INTB)*; IC25 11(NC)* 14(NC)* 19(INTB)*; IC27 3(O.S.); IC28 3(O.S.); IC45 7(NC)*

### Buses and harness runs
bus GPIO_INT[1..0] = port GPIO_INT[1..0]
bus I2C_SCL_[11..0] = port I2C_SCL_[11..0]
bus I2C_SDA_[11..0] = port I2C_SDA_[11..0]
harness SFP_0 = port SFP_0
harness SFP_1 = port SFP_1
harness SFP_2 = port SFP_2
harness SFP_3 = port SFP_3

### Notes on the sheet
- Alternative GPIO expanders.
- (near IC24) Address: 0100001 = 0x21
- Address: 1110101 = 0x75
- Address: 1110100 = 0x74
- Address: 0100000 = 0x20
- (near IC14) Shared I2C bus devices:
  Si5324: 0x68
  EEPROM: 0x57
  SFP3: 0x50 and 0x51
  GPIO expanders: 0x20 and 0x21
  I2C switches: 0x70 and 0x71
  LM75: 0x4C and 0X4F
- ASSY Variant:
  0 - MCP23017
  1- PCA9539
- Address: 1110000 = 0x70
- Shared I2C bus includes SFP_3 bus.
- (near C62) Address: 1110001 = 0x71
- Address: 1001100 = 0x4C
- (near R115) Address: 1010000 = 0x50
- Address: 1001111 = 0x4F
- (near IC15) Possible replacements:
  MAX7356ETG+
  PCA9547BS
- (near IC5) Address: 1010111 = 0x57
- (near IC45) Alternative EEPROMs:
  24AA02*
- Project/Equipment
- Document
- Designer
- Drawn by
- Check.by
- Copyright WUT ISE 2020.
  This documentation describes Open Hardware and is licensed under the CERN OHL v.1.2. You may redistribute and modify this documentation under the terms of the CERN OHL v.1.2. (http://ohwr.org/CERNOHL). This documentation is distributed WITHOUT ANY EXPRESS OR IMPLIED WARRANTY, INCLUDING OF MERCHANTABILITY, SATISFACTORY QUALITY AND FITNESS FOR A PARTICULAR PURPOSE. Please see the CERN OHL v.1.2 for applicable conditions.
- Contact
- File
- Last Mod.
- Print Date
- Sheet
- Size
- A3
- of
- Rev
- (in symbol LM75AIMM/NOPB) °C
- (in symbol R0402_1K_1%_0.0625W_100PPM) 1%
- (in symbol R0402_2K2_1%_0.0625W_100PPM) 1%
- (in symbol R0402_10K_1%_0.0625W_100PPM) 1%
- (in symbol R0402_200K_1%_0.0625W_100PPM) 1%

### Library data of the parts
C61 C62 C192 C193 C198 C203 C227 C377 C378 = CC0402_100NF_16V_10%_X7R: as C160 on sheet Kasli-SOC_SFP; Part Number: CC0402_100NF_16V_10%_X7R; Component Kind: Standard; Component Type: Standard; Pin Count: 2; Value: 100nF; Status: Not Recommended; Manufacturer Part Number: CC0402_100NF_16V_10%_X7R; Case: 0402; Mounted: Yes; Socket: No; SMD: Yes; Sense: No; Manufacturer1 Example: MURATA; Manufacturer1 ComponentHeight: 0.55mm; HelpURL: \\cern.ch\dfs\Applications\Altium\Datasheets\CC0402_X7R_MURATA_GRM.pdf; Author: CERN DEM JLC; CreateDate: 05.12.2013; LatestRevisionDate: 03.12.2007
C186 = CC0402_100PF_50V_5%_C0G: Non-polarised capacitor; Part Description: SMD Multilayer Chip Ceramic Capacitor; Manufacturer: GENERIC; Manufacturer1 Part Number: C0402C101J5GACTU; Voltage: 50V; TC: C0G/NP0; Tolerance: ±5%; Part Number: CC0402_100PF_50V_5%_C0G; Component Kind: Standard; Component Type: Standard; Pin Count: 2; Value: 100pF; Status: Preferred; Manufacturer Part Number: CC0402_100PF_50V_5%_C0G; Case: 0402; Mounted: Yes; Socket: No; SMD: Yes; Sense: No; Manufacturer1 Example: KEMET; Manufacturer1 ComponentHeight: 0.55mm; HelpURL: \\cern.ch\dfs\Applications\Altium\Datasheets\CC0805_C0G_KEMET_(Commercial Grade).pdf; Author: CERN DEM JLC; CreateDate: 03.12.2007; LatestRevisionDate: 22.04.2015
C196 C197 = CC0201_100NF_6.3V_10%_X5R: as C30-C37 on sheet Kasli-SOC_IDC_EXT_Connectors; Part Number: CC0201_100NF_6.3V_10%_X5R; Component Kind: Standard; Component Type: Standard; Pin Count: 2; Value: 100nF; Status: Not Recommended; Manufacturer Part Number: CC0201_100NF_6.3V_10%_X5R; Case: 0201; Mounted: Yes; Socket: No; SMD: Yes; Sense: No; Manufacturer1 Example: AVX; Manufacturer1 ComponentHeight: 0.33mm; HelpURL: \\cern.ch\dfs\Applications\Altium\Datasheets\CC0201_X5R_AVX.pdf; Author: CERN DEM JLC; CreateDate: 2007-12-03; LatestRevisionDate: 2007-12-03
C379 = CC0402_100NF_16V_10%_X5R: Non-polarised capacitor; Part Description: SMD Multilayer Chip Ceramic Capacitor; Manufacturer: GENERIC; Manufacturer1 Part Number: GRM155R61C104KA88D; Voltage: 16V; TC: X5R; Tolerance: ±10%; Part Number: CC0402_100NF_16V_10%_X5R; Component Kind: Standard; Component Type: Standard; Pin Count: 2; Value: 100nF; Status: None; Manufacturer Part Number: CC0402_100NF_16V_10%_X5R; Case: 0402; Mounted: Yes; Socket: No; SMD: Yes; Sense: No; Manufacturer1 Example: MURATA; Manufacturer1 ComponentHeight: 0.55mm; HelpURL: \\cern.ch\dfs\Applications\Altium\Datasheets\CC0402_X5R_MURATA_GRM.pdf; Author: CERN DEM JLC; CreateDate: 2013-12-10; LatestRevisionDate: 2013-12-10
IC5 IC45 = 24AA025E48-I/SN: 1.7V-5.5V, 2K I2C™ Serial EEPROMs with EUI-48™ Node Identity; Manufacturer: MICROCHIP TECHNOLOGY; PressFit: No; Bonding: No; Part Number: 24AA025E48-I/SN; Component Kind: Standard; Component Type: Standard; Device: 24AA025E48-I/SN; Part Description: 1.7V-5.5V, 2K I2C™ Serial EEPROMs with EUI-48™ Node Identity; Manufacturer Part Number: 24AA025E48-I/SN; Pin Count: 8; Case: SOIC8; Mounted: Yes; Socket: No; SMD: Yes; Sense: No; ComponentHeight: 1.75mm; HelpURL: \\cern.ch\dfs\Applications\Altium\Datasheets\24AA025E48-I-SN.pdf; Author: CERN DEM MR
  IC5: PackageDescription: SOIC 8, Pitch 1.27mm - Body 4x5mm, IPC Medium Density; CreateDate: 19.07.2016; LatestRevisionDate: 19.07.2016
  IC45: PackageDescription: SOIC, 1.27mm Pitch; 8 Pin - Body 4x5mm, IPC Medium Density; CreateDate: 2016-07-19; LatestRevisionDate: 2016-07-19
IC13 = PCA9306DCTR: Dual Bidirectional I2C Bus And SMBus Voltage-Level Translator; Manufacturer: TEXAS INSTRUMENTS; PressFit: No; Bonding: No; Part Number: PCA9306DCTR; Component Kind: Standard; Component Type: Standard; Device: PCA9306DCTR; PackageDescription: SOP, 0.65mm, Pitch; 8 Pin, 2.80mm W X 2.95mm L X 1.30mm H Body, PC Medium Density; Part Description: Dual Bidirectional I2C Bus And SMBus Voltage-Level Translator; Manufacturer Part Number: PCA9306DCTR; Pin Count: 8; Case: SSOP8; Mounted: Yes; Socket: No; SMD: Yes; Sense: No; ComponentHeight: 1.3mm; Author: CERN DEM JLC; HelpURL: \\cern.ch\dfs\Applications\Altium\Datasheets\PCA9306DCTR.pdf; CreateDate: 25.02.2013; LatestRevisionDate: 11.02.2016
IC14 IC15 = TCA9548ARGER: Low Voltage 8-Channel I2C Switch With Reset; Manufacturer: TEXAS INSTRUMENTS; PressFit: No; Bonding: No; Part Number: TCA9548ARGER; Component Kind: Standard; Component Type: Standard; Device: TCA9548ARGER; PackageDescription: QFN, 0.50mm Pitch, Square; 24 Pin, 4.00mm L X 4.00mm W X 1.00mm H body (w/thermal tab 2.2 X 2.2mm), IPC Medium Density; Part Description: Low Voltage 8-Channel I2C Switch With Reset; Manufacturer Part Number: TCA9548ARGER; Pin Count: 25; Case: QFN24; Mounted: Yes; Socket: No; SMD: Yes; Sense: No; ComponentHeight: 1mm; Author: CERN DEM JLC; HelpURL: \\cern.ch\dfs\Applications\Altium\Datasheets\TCA9548ARGER.pdf; CreateDate: 07.07.2014; LatestRevisionDate: 07.07.2014
IC24 IC25 = MCP23017-E/SS: 16-bit I/O Port Expander With Serial Interface; Manufacturer: MICROCHIP TECHNOLOGY; PressFit: No; Bonding: No; Part Number: MCP23017-E/SS; Component Kind: Standard; Component Type: Standard; Device: MCP23017-E/SS; PackageDescription: SOP, 0.65mm Pitch; 28 pin, 5.30mm W X 10.20mm L X 2.00mm H body, IPC Medium Density; Part Description: 16-bit I/O Port Expander With Serial Interface; Manufacturer Part Number: MCP23017-E/SS; Pin Count: 28; Case: SSOP28; Mounted: Yes; Socket: No; SMD: Yes; Sense: No; ComponentHeight: 2mm; Author: CERN DEM JLC; HelpURL: \\cern.ch\dfs\Applications\Altium\Datasheets\MCP23017-E-SS.pdf; CreateDate: 2011-01-17; LatestRevisionDate: 2011-01-17
IC27 IC28 = LM75AIMM/NOPB: Digital Temperature Sensor and Thermal Watchdog with Two-Wire Interface; Part Description: -25° to +100°C ±2°C Digital Temperature Sensor and Thermal Watchdog with Two-Wire Interface; Manufacturer: TEXAS INSTRUMENTS; PressFit: No; Bonding: No; Part Number: LM75AIMM/NOPB; Component Kind: Standard; Component Type: Standard; Device: LM75AIMM/NOPB; PackageDescription: SOP, 0.65mm pitch; 8 pin,3.00mm W X 3.00mm L X 1.09mm H bodyI, PC Medium Density; Manufacturer Part Number: LM75AIMM/NOPB; Pin Count: 8; Case: SSOP8; Mounted: Yes; Socket: No; SMD: Yes; Sense: No; ComponentHeight: 1.09mm; HelpURL: \\cern.ch\dfs\Applications\Altium\Datasheets\LM75AIMM-NOPB.pdf; Author: CERN DEM JLC; CreateDate: 15.10.2012; LatestRevisionDate: 15.10.2012
IC42 IC43 = PCA9539APW: Low-Voltage 16-Bit I2C-Bus I/O Port with Interrupt and Reset; Manufacturer: NXP SEMICONDUCTORS; PressFit: No; Bonding: No; Part Number: PCA9539APW; Component Kind: Standard; Component Type: Standard; Device: PCA9539APW; PackageDescription: SOP, 0.65mm Pitch; 24 Pin, 4.40mm W X 7.80mm L X 1.10mm H body, IPC Medium Density; Part Description: Low-Voltage 16-Bit I2C-Bus I/O Port with Interrupt and Reset; Manufacturer Part Number: PCA9539APW; Pin Count: 24; Case: TSSOP24; Mounted: Yes; Socket: No; SMD: Yes; Sense: No; ComponentHeight: 1.1mm; Author: CERN DEM JMW; HelpURL: \\cern.ch\dfs\Applications\Altium\Datasheets\PCA9539APW.pdf; CreateDate: 2020-08-06; LatestRevisionDate: 2020-08-06
IC44 = 24AA025E48T-I/OT: 1.7V-5.5V, 2K I2C Serial EEPROM With EUI-48 Node Identity; Part Description: 1.7V-5.5V, 2K I2C Serial EEPROM With EUI-48™ Node Identity; Cascadable; Manufacturer: MICROCHIP TECHNOLOGY; PressFit: No; Bonding: No; Part Number: 24AA025E48T-I/OT; Component Kind: Standard; Component Type: Standard; Device: 24AA025E48T-I/OT; PackageDescription: SOT, 0.95mm pitch; 6 pin, 1.60mm W X 2.90mm L X 1.45mm H body, IPC Medium Density; Manufacturer Part Number: 24AA025E48T-I/OT; Pin Count: 6; Case: SOT23-6; Mounted: Yes; Socket: No; SMD: Yes; Sense: No; ComponentHeight: 1.45mm; HelpURL: \\cern.ch\dfs\Applications\Altium\Datasheets\24AA025E48T-I-OT.pdf; Author: CERN DEM BC; CreateDate: 2019-12-06; LatestRevisionDate: 2019-12-06
R33 R148 R149 = R0402_2K2_1%_0.0625W_100PPM: Resistor - 1%; Part Description: General Purpose Thick Film Chip Resistor; Manufacturer: GENERIC; Manufacturer1 Part Number: 232270672202L; TC: ±100ppm/°C; PressFit: No; Part Number: R0402_2K2_1%_0.0625W_100PPM; Component Kind: Standard; Component Type: Standard; Pin Count: 2; Value: 2k2; Status: Not Recommended; Power: 0.0625W; Manufacturer Part Number: R0402_2K2_1%_0.0625W_100PPM; Case: 0402; Mounted: Yes; Sense: No; Socket: No; SMD: Yes; Manufacturer1 Example: YAGEO PHYCOMP; Manufacturer1 ComponentHeight: 0.4mm; HelpURL: \\cern.ch\dfs\Applications\Altium\Datasheets\R0402_Phycomp_RC0402.pdf; Author: CERN DEM JLC; CreateDate: 03.12.2007; LatestRevisionDate: 17.10.2012
  R148 R149: Tolerance: ±1%
R46 R115 R116 R125 R146 R147 R151 R155-R173 R175 R176 R178 R180 R182-R190 = R0402_10K_1%_0.0625W_100PPM: as R130 on sheet Kasli-SOC_SFP; Part Number: R0402_10K_1%_0.0625W_100PPM; Component Kind: Standard; Component Type: Standard; Pin Count: 2; Value: 10k; Status: Not Recommended; Power: 0.0625W; Tolerance: ±1%; Manufacturer Part Number: R0402_10K_1%_0.0625W_100PPM; Case: 0402; Mounted: Yes; Sense: No; Socket: No; SMD: Yes; Manufacturer1 Example: YAGEO PHYCOMP; Manufacturer1 ComponentHeight: 0.4mm; HelpURL: \\cern.ch\dfs\Applications\Altium\Datasheets\R0402_Phycomp_RC0402.pdf; Author: CERN DEM JLC; CreateDate: 03.12.2007; LatestRevisionDate: 17.10.2012
R118-R123 = R0402_1K_1%_0.0625W_100PPM: Resistor - 1%; Part Description: General Purpose Thick Film Chip Resistor; Manufacturer: GENERIC; Manufacturer1 Part Number: 232270671002L; TC: ±100ppm/°C; PressFit: No; Part Number: R0402_1K_1%_0.0625W_100PPM; Component Kind: Standard; Component Type: Standard; Pin Count: 2; Value: 1k; Status: Not Recommended; Power: 0.0625W; Tolerance: ±1%; Manufacturer Part Number: R0402_1K_1%_0.0625W_100PPM; Case: 0402; Mounted: Yes; Sense: No; Socket: No; SMD: Yes; Manufacturer1 Example: YAGEO PHYCOMP; Manufacturer1 ComponentHeight: 0.4mm; HelpURL: \\cern.ch\dfs\Applications\Altium\Datasheets\R0402_Phycomp_RC0402.pdf; Author: CERN DEM JLC; CreateDate: 03.12.2007; LatestRevisionDate: 17.10.2012
R131 R132 R228-R235 = R0402_0R_JUMPER: Resistor; Part Description: 1A (0.05R Max DC Resistance) Zero Ohm Jumper; Manufacturer: GENERIC; Manufacturer1 Part Number: 232270591001L; PressFit: No; Part Number: R0402_0R_JUMPER; Component Kind: Standard; Component Type: Standard; Pin Count: 2; Value: 0; Status: Not Recommended; Manufacturer Part Number: R0402_0R_JUMPER; Case: 0402; Mounted: Yes; Sense: No; Socket: No; SMD: Yes; Manufacturer1 Example: YAGEO PHYCOMP; Manufacturer1 ComponentHeight: 0.4mm; HelpURL: \\cern.ch\dfs\Applications\Altium\Datasheets\R0402_Phycomp_RC0402.pdf; Author: CERN DEM JLC
  R131 R132: CreateDate: 2007-12-03; LatestRevisionDate: 2012-10-17
  R228-R235: CreateDate: 03.12.2007; LatestRevisionDate: 17.10.2012
R240 = R0402_200K_1%_0.0625W_100PPM: Resistor - 1%; Part Description: General Purpose Thick Film Chip Resistor; Manufacturer: GENERIC; Manufacturer1 Part Number: 232270672004L; TC: ±100ppm/°C; PressFit: No; Part Number: R0402_200K_1%_0.0625W_100PPM; Component Kind: Standard; Component Type: Standard; Pin Count: 2; Value: 200k; Status: Not Recommended; Power: 0.0625W; Tolerance: ±1%; Manufacturer Part Number: R0402_200K_1%_0.0625W_100PPM; Case: 0402; Mounted: Yes; Sense: No; Socket: No; SMD: Yes; Manufacturer1 Example: YAGEO PHYCOMP; Manufacturer1 ComponentHeight: 0.4mm; HelpURL: \\cern.ch\dfs\Applications\Altium\Datasheets\R0402_Phycomp_RC0402.pdf; Author: CERN DEM JLC; CreateDate: 03.12.2007; LatestRevisionDate: 17.10.2012
T21 T22 = BSH103: as T11 on sheet Kasli-SOC_SFP; Part Number: BSH103; Component Kind: Standard; Component Type: Standard; Device: BSH103; PackageDescription: SOT23, 3 pin, Pitch 0.95mm - 1.3mm W X 2.9mm L X 1.1mm H, IPC Medium Density; Manufacturer Part Number: BSH103; Pin Count: 3; Case: SOT23-3; Mounted: Yes; Socket: No; SMD: Yes; Sense: No; ComponentHeight: 1.1mm; HelpURL: \\cern.ch\dfs\Applications\Altium\Datasheets\BSH103.pdf; Author: CERN DEM JLC; CreateDate: 16.03.2010; LatestRevisionDate: 20.06.2017; ClassName: Artix
TP2 TP3 TP11 TP13 TP14 TP31 = SMD_PAD_1.27X1.27MM: Test Point; Part Description: 1.27mm x 1.27mm PCB Copper Area (SMD Test Point); Mounted: No; Part Number: SMD_PAD_1.27X1.27MM; Component Type: Standard (No BOM); Pin Count: 1; Family: Test Point; Socket: No; SMD: Yes; Sense: No; Status: None; ComponentHeight: 0mm; HelpURL: Undefined; Author: CERN DEM JLC; CreateDate: 12.01.2008; LatestRevisionDate: 12.01.2008; PackageDescription: 1.27mm x 1.27mm PCB Copper Area (SMD Test Point)